# Altium schematic sheet 0032_DEGUG-JTAG.SchDoc
size A3
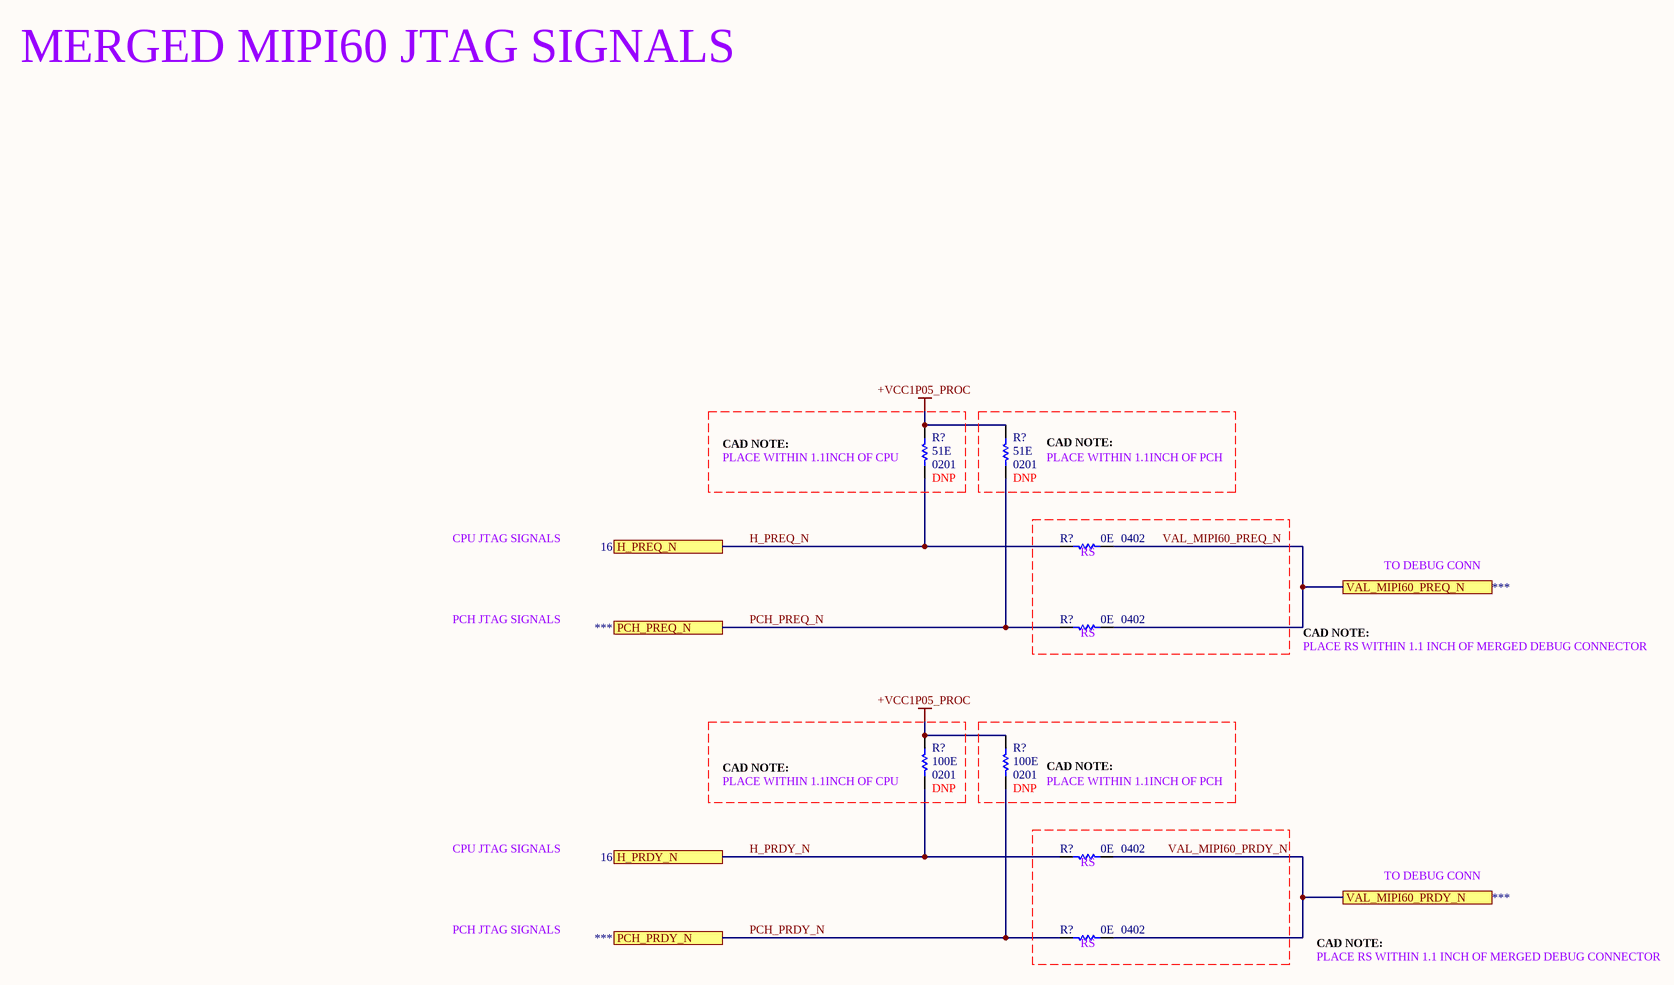
[diagram p0: 0032_DEGUG-JTAG.SchDoc]

## Parts
(Parts that share a designator on the sheet are numbered #1, #2 ... from top to bottom, then left to right.)
R?#1  value 51E  Case/Package: 0201  [RESC0201]  (hidden comment: Res)
R?#2  value 51E  Case/Package: 0201  [RESC0201]  (hidden comment: Res)
R?#3  value 0E  Case/Package: 0402  [RESC0402]  (hidden comment: Res)
R?#4  value 0E  Case/Package: 0402  [RESC0402]  (hidden comment: Res)
R?#5  value 100E  Case/Package: 0201  [RESC0201]  (hidden comment: Res)
R?#6  value 100E  Case/Package: 0201  [RESC0201]  (hidden comment: Res)
R?#7  value 0E  Case/Package: 0402  [RESC0402]  (hidden comment: Res)
R?#8  value 0E  Case/Package: 0402  [RESC0402]  (hidden comment: Res)

## Ports
H_PRDY_N, H_PREQ_N, PCH_PRDY_N, PCH_PREQ_N, VAL_MIPI60_PRDY_N, VAL_MIPI60_PREQ_N

## Nets
+VCC1P05_PROC: R?#1.2 R?#2.2 R?#5.2 R?#6.2
H_PRDY_N: R?#5.1 R?#7.1 ; port H_PRDY_N
H_PREQ_N: R?#1.1 R?#3.1 ; port H_PREQ_N
PCH_PRDY_N: R?#6.1 R?#8.1 ; port PCH_PRDY_N
PCH_PREQ_N: R?#2.1 R?#4.1 ; port PCH_PREQ_N
VAL_MIPI60_PRDY_N: R?#7.2 R?#8.2 ; port VAL_MIPI60_PRDY_N
VAL_MIPI60_PREQ_N: R?#3.2 R?#4.2 ; port VAL_MIPI60_PREQ_N

## Notes on the sheet
- MERGED MIPI60 JTAG SIGNALS
- CAD NOTE:
- (near R?#1) PLACE WITHIN 1.1INCH OF CPU
- (near R?#2) CAD NOTE:
- (near R?#2) PLACE WITHIN 1.1INCH OF PCH
- CPU JTAG SIGNALS
- (near R?#3) RS
- PCH JTAG SIGNALS
- TO DEBUG CONN
- (near R?#4) RS
- PLACE RS WITHIN 1.1 INCH OF MERGED DEBUG CONNECTOR
- (near R?#5) PLACE WITHIN 1.1INCH OF CPU
- (near R?#6) CAD NOTE:
- (near R?#6) PLACE WITHIN 1.1INCH OF PCH
- (near R?#7) RS
- (near R?#8) RS

## Library data of the parts
R?#1 R?#2 = Res: Thick Film Resistor -  51ohm, 1%, 0201; DNP: DNP
R?#3 R?#4 R?#7 R?#8 = Res: Thick Film Resistor -  0ohm, 1%, 0402
R?#5 R?#6 = Res: Thick Film Resistor -  100ohm, 1%, 0201; DNP: DNP